# Altium project Hand_Santi.PrjPcb
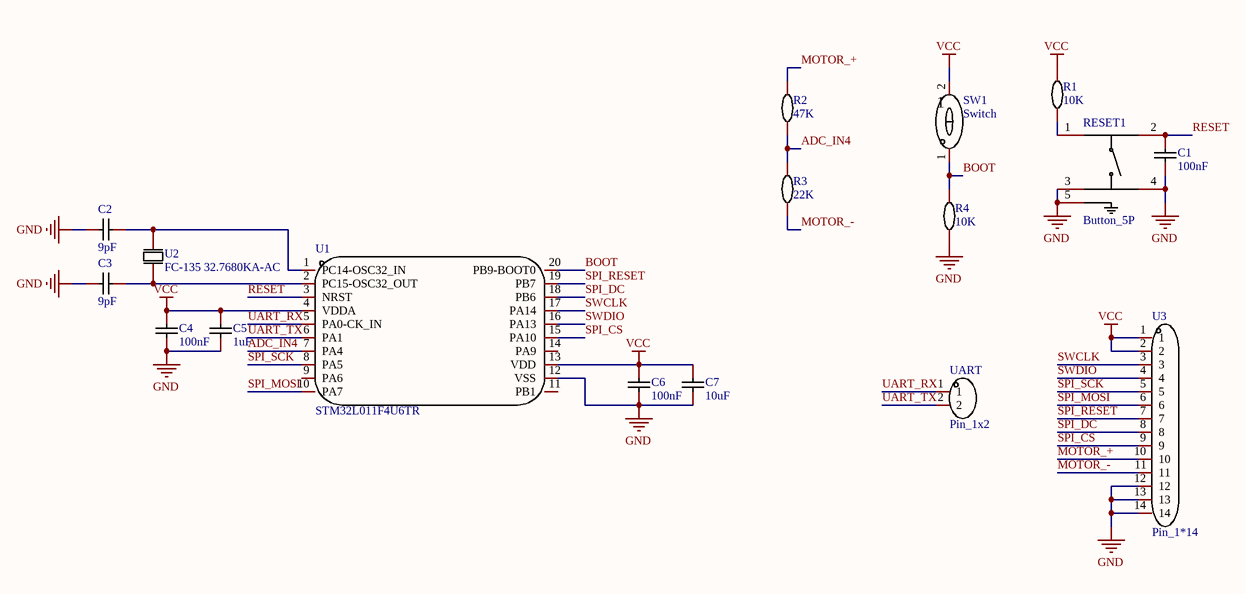
[diagram p0: Sheet1.SchDoc]
1 sheet, 17 parts. Net scope: global (net labels, ports and power ports of the same name join across sheets).
Board file: PCB2.PcbDoc

## Sheet Sheet1.SchDoc
size A4; SheetNumber: 1; SheetTotal: 1

### Parts
C1  100nF  [C0402]
C2  9pF  [C0402]
C3  9pF  [C0402]
C4  100nF  [C0402]
C5  1uF  [C0402]
C6  100nF  [C0402]
C7  10uF  [C0402]
R1  10K  [R0603]
R2  47K  [R0603]
R3  22K  [R0603]
R4  10K  [R0603]
RESET1  Button_5P  [Button_3.3x3.3mm]
SW1  Switch  [Switch]
U1  STM32L011F4U6TR  [STM32L011F4]
U2  FC-135 32.7680KA-AC  [CRYSTAL-SMD_L3.2-W1.5]
U3  Pin_1*14  [Pin_1*14]
UART  Pin_1x2  [Pin1x2_2.54mm]

### Nets
GND: C1.1 C2.1 C3.1 C4.1 C5.1 C6.1 C7.1 R4.1 RESET1.3(C) RESET1.4(D) RESET1.5(GND) U1.12(VSS) U3.12 U3.13 U3.14
VCC: C4.2 C5.2 C6.2 C7.2 R1.2 SW1.2(PIN2) U1.4(VDDA) U1.13(VDD) U3.1 U3.2
ADC_IN4: R2.1 R3.2 U1.7(PA4)
BOOT: R4.2 SW1.1(PIN1) U1.20(PB9-BOOT0)
MOTOR_+: R2.2 U3.10
MOTOR_-: R3.1 U3.11
RESET: C1.2 RESET1.2(B) U1.3(NRST)
SPI_CS: U1.15(PA10) U3.9
SPI_DC: U1.18(PB6) U3.8
SPI_MOSI: U1.10(PA7) U3.6
SPI_RESET: U1.19(PB7) U3.7
SPI_SCK: U1.8(PA5) U3.5
SWCLK: U1.17(PA14) U3.3
SWDIO: U1.16(PA13) U3.4
UART_RX: U1.5(PA0-CK_IN) UART.1
UART_TX: U1.6(PA1) UART.2
NetC2_2: C2.2 U1.1(PC14-OSC32_IN) U2.2(OSC2)
NetC3_2: C3.2 U1.2(PC15-OSC32_OUT) U2.1(OSC1)
NetR1_1: R1.1 RESET1.1(A)

Not connected (* = marked no-connect by the designer): U1 9(PA6) 11(PB1) 14(PA9)

### Library data of the parts
C1-C7 = C
R1-R4 = R
U1 = STM32L011F4